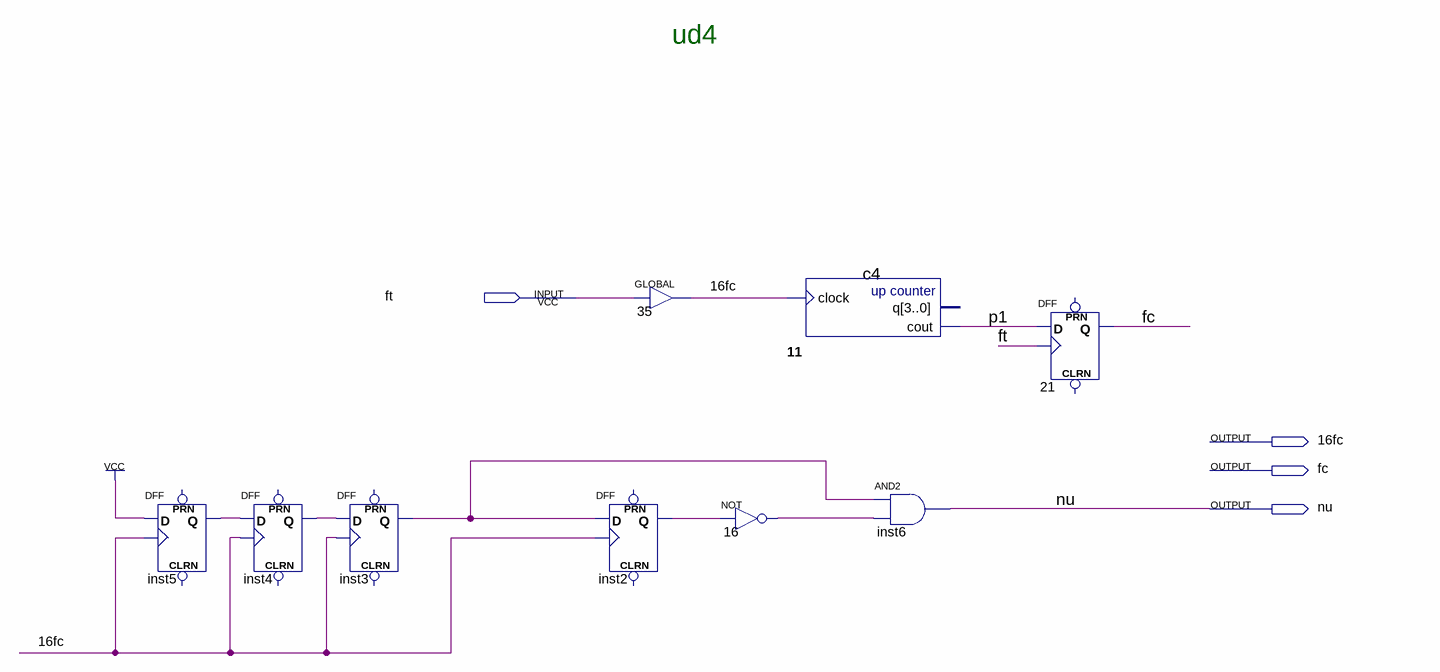
[diagram p0: schematic sheet]
// Quartus schematic ud4.bdf as structural Verilog: 9 symbols, 4 pins
module ud4 (
  input  ft,
  output \16fc ,
  output fc,
  output nu
);

  wire inst2_q, inst3_q, inst4_q, inst5_q, n16_out, p1;

  DFF inst5 (.CLK(\16fc ), .D(1'b1), .Q(inst5_q));  // open: CLRN, PRN
  DFF inst4 (.CLK(\16fc ), .D(inst5_q), .Q(inst4_q));  // open: CLRN, PRN
  DFF inst3 (.CLK(\16fc ), .D(inst4_q), .Q(inst3_q));  // open: CLRN, PRN
  GLOBAL u_35 (.IN(ft), .OUT(\16fc ));
  DFF inst2 (.CLK(\16fc ), .D(inst3_q), .Q(inst2_q));  // open: CLRN, PRN
  not u_16 (n16_out, inst2_q);
  c4 u_11 (.clock(\16fc ), .cout(p1));  // open: q
  and inst6 (nu, inst3_q, n16_out);
  DFF u_21 (.CLK(ft), .D(p1), .Q(fc));  // open: CLRN, PRN

  // Notes on the sheet:
  //   ud4
endmodule
